# EAGLE design ir02 (EAGLE 9.6.2)
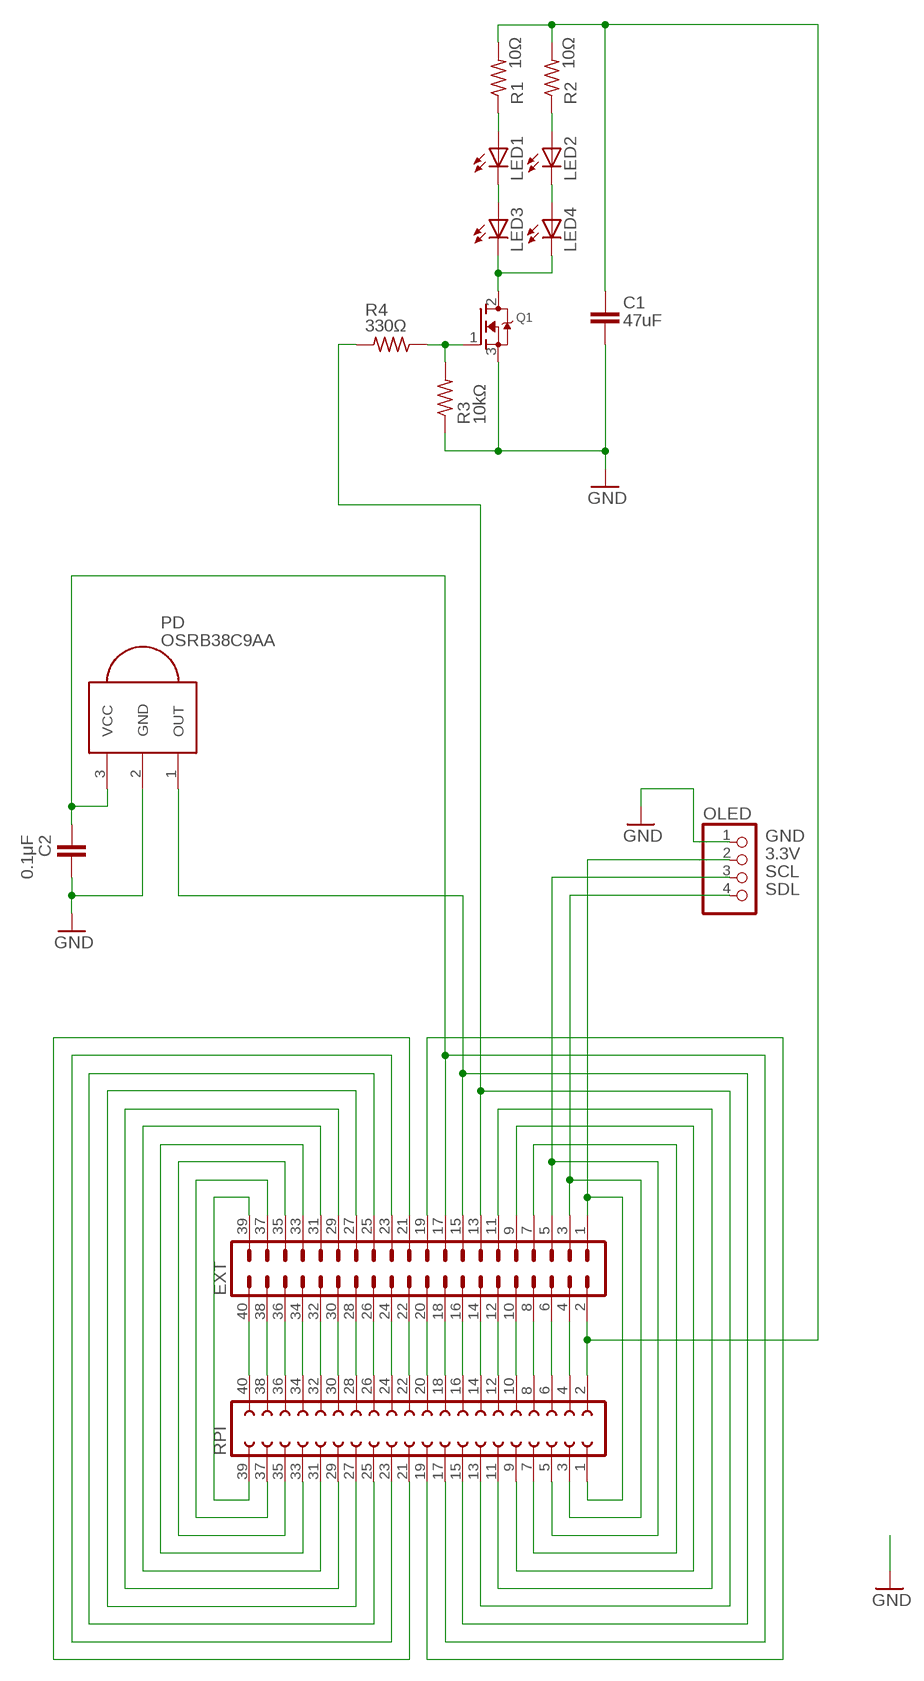
[diagram p0: schematic, sheet 1]

## Parts
C1  47uF  C-EU025-025X050  [C025-025X050]
C2  0.1μF  C-EU025-025X050  [C025-025X050]
EXT  MA20-2  [MA20-2]
LED1  LED3MM  [LED3MM]
LED2  LED3MM  [LED3MM]
LED3  LED3MM  [LED3MM]
LED4  LED3MM  [LED3MM]
OLED  PINHD-1X4  [1X04]
PD  OSRB38C9AA  PNA460XM  [PNA460XM]
Q1  MOSFET-NGDS_TO220V  [TO220V]
R1  10Ω  R-US_0204/5  [0204/5]
R2  10Ω  R-US_0204/5  [0204/5]
R3  10kΩ  R-US_0204/5  [0204/5]
R4  330Ω  R-US_0204/5  [0204/5]
RPI  FE20-2  [FE20-2]

## Nets
3.3V: C2.1 EXT.1 EXT.17 OLED.2 PD.3(VCC) RPI.1 RPI.17
5V: C1.1 EXT.2 R1.2 R2.2 RPI.2
GND: C1.2 C2.2 EXT.6 EXT.9 EXT.14 EXT.34 EXT.39 OLED.1 PD.2(GND) Q1.3(S) R3.1 RPI.6 RPI.9 RPI.14 RPI.34 RPI.39
N$1: Q1.1(G) R3.2 R4.1
N$4: LED1.A R1.1
N$5: LED2.A R2.1
N$6: EXT.15 PD.1(OUT) RPI.15
N$7: LED1.K(C) LED3.A
N$8: LED2.K(C) LED4.A
N$9: LED3.K(C) LED4.K(C) Q1.2(D)
N$10: EXT.4 RPI.4
N$12: EXT.8 RPI.8
N$13: EXT.10 RPI.10
N$14: EXT.12 RPI.12
N$16: EXT.16 RPI.16
N$17: EXT.18 RPI.18
N$18: EXT.20 RPI.20
N$19: EXT.22 RPI.22
N$20: EXT.24 RPI.24
N$21: EXT.26 RPI.26
N$22: EXT.28 RPI.28
N$23: EXT.30 RPI.30
N$24: EXT.32 RPI.32
N$26: EXT.36 RPI.36
N$27: EXT.38 RPI.38
N$28: EXT.40 RPI.40
N$32: EXT.7 RPI.7
N$34: EXT.11 RPI.11
N$35: EXT.13 R4.2 RPI.13
N$37: EXT.37 RPI.37
N$38: EXT.35 RPI.35
N$39: EXT.33 RPI.33
N$40: EXT.31 RPI.31
N$41: EXT.29 RPI.29
N$42: EXT.27 RPI.27
N$43: EXT.25 RPI.25
N$44: EXT.23 RPI.23
N$45: EXT.21 RPI.21
N$48: EXT.19 RPI.19
SCL: EXT.5 OLED.3 RPI.5
SDL: EXT.3 OLED.4 RPI.3

## Library data of the parts
C1 C2 = rcl:C-EU: CAPACITOR, European symbol; SPICEPREFIX: C
EXT = con-lstb:MA20-2: PIN HEADER; OC_FARNELL: unknown; OC_NEWARK: unknown
LED1-LED4 = adafruit:LED: LED OSRAM: - CHIPLED LG R971, LG N971, LY N971, LG Q971, LY Q971, LO R971, LY R971 LH N974, LH R974 LS Q976, LO Q976, LY Q976 LO Q996 - Hyper CHIPLED LW Q18S LB Q993, LB Q99A, LB R99A - SideLED LS A670, LO A670, LY A670, LG A670, LP A670 LB A673, LV A673, LT A673, LW A673 LH A674 LY A675 LS A676, LA A676, LO A676, LY A676, LW A676 LS A679, LY A679, LG A679 - Hyper Micro SIDELED® LS Y876, LA Y876, LO Y876, LY Y876 LT Y87S - SmartLED LW L88C, LW L88S LB L89C, LB L89S, LG L890 LS L89K, LO L89K, LY L89K LS L896, LA L896, LO L896, LY L896 - TOPLED LS T670, LO T670, LY T670, LG T670, LP T670 LSG T670, LSP T670, LSY T670, LOP T670, LYG T670 LG T671, LOG T671, LSG T671 LB T673, LV T673, LT T673, LW T673 LH T674 LS T676, LA T676, LO T676, LY T676, LB T676, LH T676, LSB T676, LW T676 LB T67C, LV T67C, LT T67C, LS T67K, LO T67K, LY T67K, LW E67C LS E67B, LA E67B, LO E67B, LY E67B, LB E67C, LV E67C, LT E67C LW T67C LS T679, LY T679, LG T679 LS T770, LO T770, LY T770, LG T770, LP T770 LB T773, LV T773, LT T773, LW T773 LH T774 LS E675, LA E675, LY E675, LS T675 LS T776, LA T776, LO T776, LY T776, LB T776 LHGB T686 LT T68C, LB T68C - Hyper Mini TOPLED® LB M676 - Mini TOPLED Santana® LG M470 LS M47K, LO M47K, LY M47K Source: http://www.osram.convergy.de/
OLED = pinhead:PINHD-1X4: PIN HEADER
PD = adafruit:PNA460XM: IR 38KHz receiver PNA4602 and related receivers http://www.ladyada.net/library/pcb/eaglelibrary.html
Q1 = adafruit:MOSFET-N: N-Channel Mosfet 2N7002E - 60V 260mA SOT23 [Digikey: 2N7002ET1GOSTR-ND] - REEL BSH103 - 30V 850mA SOT23 [Digikey: 568-5013-1-ND]
R1-R4 = rcl:R-US_: RESISTOR, American symbol; SPICEPREFIX: R
RPI = con-lsta:FE20-2: FEMALE HEADER; OC_FARNELL: unknown; OC_NEWARK: unknown

## Board
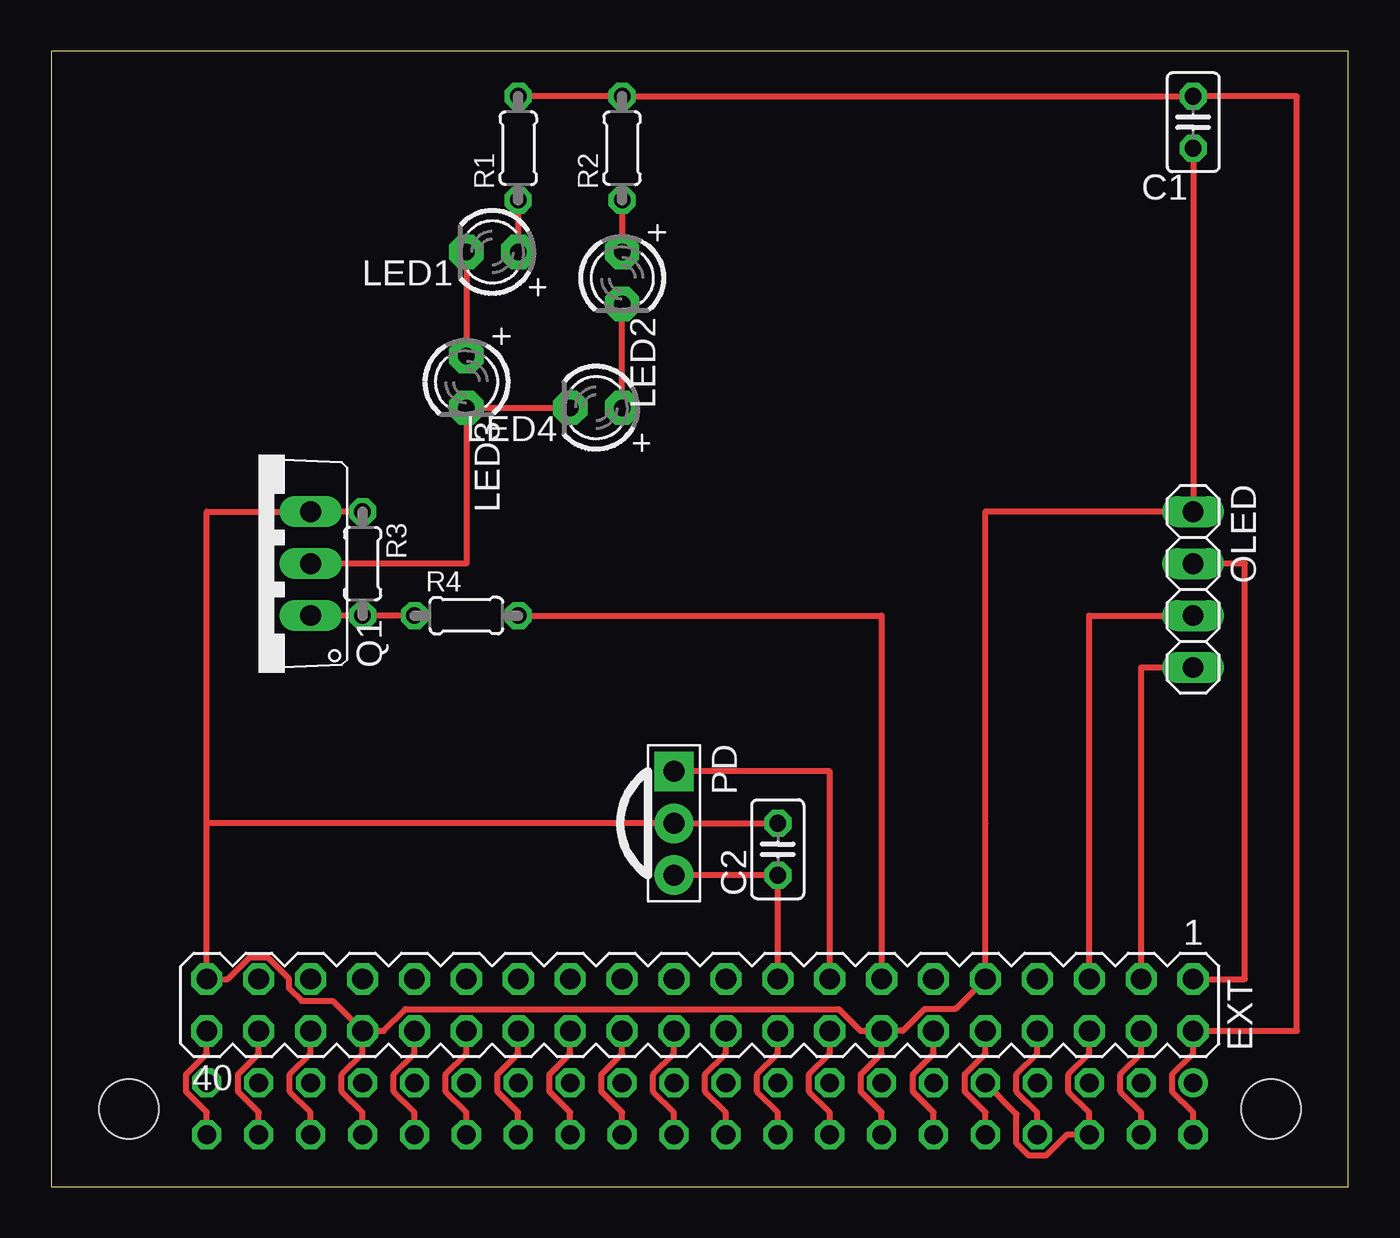
[diagram p1: board, top side]
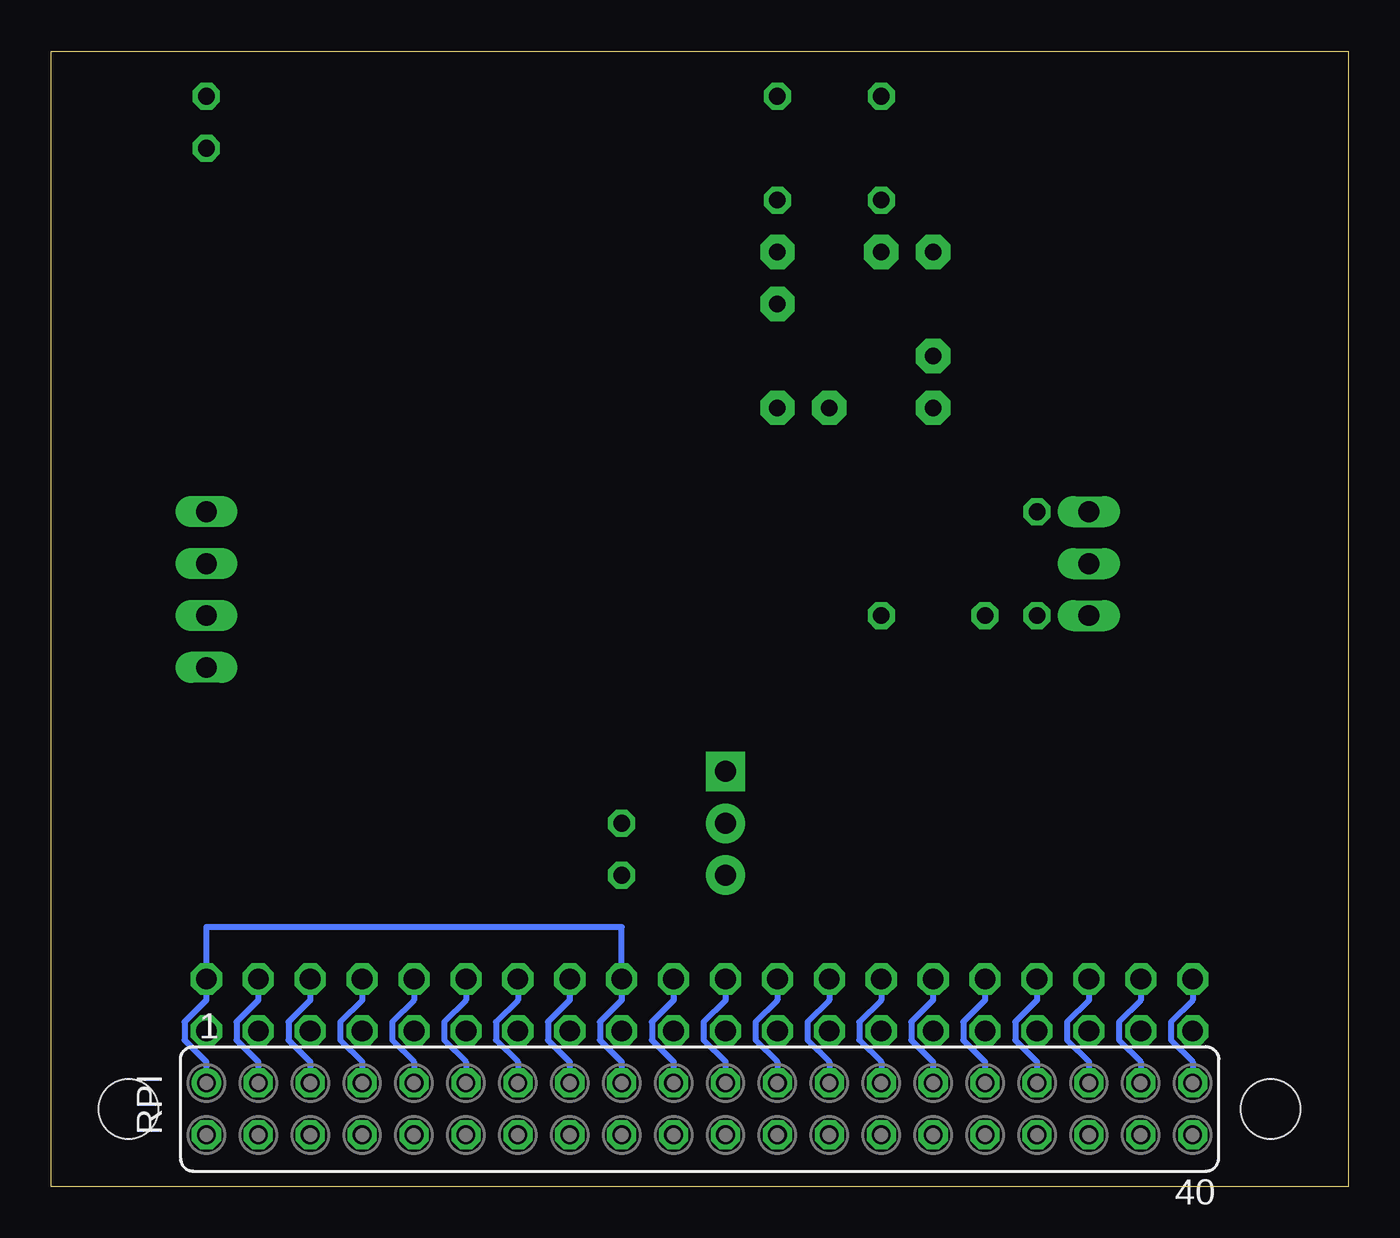
[diagram p2: board, bottom side, seen from below]

Size 63.48 x 55.55 mm. Coordinates in mm from the lower left corner, seen from the top.
Outline: 0,0 63.48,0 63.48,55.55 0,55.55 0,0
Copper layers (1*16): Top 0.035mm / dielectric 1.5mm / Bottom 0.035mm
Design rules "SeeedStudio_2layer_DRU_no_angle_20140221": minimum track width 6mil, minimum drill 12mil, track to track 6mil, track to pad 6mil, pad to pad 6mil, via to via 6mil, smd to smd 0mil, copper to edge 10mil, drill to drill 10mil, minimum pad ring 10mil, minimum via ring 6mil, stop-mask expansion 2mil, vias tented up to drill 100mil, thermal gap 10mil
Holes 2.9 mm at 3.81,3.81 59.69,3.81

### Footprints (pad centres in the part's own frame; a part is rotated, then mirrored left to right if it is on the bottom)
C025-025X050 = drill 0.813 octagon: 1 -1.27,0; 2 1.27,0
MA20-2 = drill 1.016 octagon: 1 -24.13,-1.27; 2 -24.13,1.27; 3 -21.59,-1.27; 4 -21.59,1.27; 5 -19.05,-1.27; 6 -19.05,1.27; 7 -16.51,-1.27; 8 -16.51,1.27; 9 -13.97,-1.27; 10 -13.97,1.27; 11 -11.43,-1.27; 12 -11.43,1.27; 13 -8.89,-1.27; 14 -8.89,1.27; 15 -6.35,-1.27; 16 -6.35,1.27; 17 -3.81,-1.27; 18 -3.81,1.27; 19 -1.27,-1.27; 20 -1.27,1.27; 21 1.27,-1.27; 22 1.27,1.27; 23 3.81,-1.27; 24 3.81,1.27; 25 6.35,-1.27; 26 6.35,1.27; 27 8.89,-1.27; 28 8.89,1.27; 29 11.43,-1.27; 30 11.43,1.27; 31 13.97,-1.27; 32 13.97,1.27; 33 16.51,-1.27; 34 16.51,1.27; 35 19.05,-1.27; 36 19.05,1.27; 37 21.59,-1.27; 38 21.59,1.27; 39 24.13,-1.27; 40 24.13,1.27
LED3MM = drill 0.813 pad 1.676 octagon: A -1.27,0; K 1.27,0
1X04 = drill 1.016 long: 1 -3.81,0; 2 -1.27,0; 3 1.27,0; 4 3.81,0
PNA460XM = drill 1.016 pad 1.93 square: 1 -2.54,0 | drill 1.016 pad 1.93: 2 0,0; 3 2.54,0
TO220V = drill 1.016 long: 1 -2.54,-2.54; 2 0,-2.54; 3 2.54,-2.54
0204/5 = drill 0.813 octagon: 1 -2.54,0; 2 2.54,0
FE20-2 = drill 0.914: 1 -24.13,1.27 | drill 0.914 octagon: 2 -24.13,-1.27; 3 -21.59,1.27; 4 -21.59,-1.27; 5 -19.05,1.27; 6 -19.05,-1.27; 7 -16.51,1.27; 8 -16.51,-1.27; 9 -13.97,1.27; 10 -13.97,-1.27; 11 -11.43,1.27; 12 -11.43,-1.27; 13 -8.89,1.27; 14 -8.89,-1.27; 15 -6.35,1.27; 16 -6.35,-1.27; 17 -3.81,1.27; 18 -3.81,-1.27; 19 -1.27,1.27; 20 -1.27,-1.27; 21 1.27,1.27; 22 1.27,-1.27; 23 3.81,1.27; 24 3.81,-1.27; 25 6.35,1.27; 26 6.35,-1.27; 27 8.89,1.27; 28 8.89,-1.27; 29 11.43,1.27; 30 11.43,-1.27; 31 13.97,1.27; 32 13.97,-1.27; 33 16.51,1.27; 34 16.51,-1.27; 35 19.05,1.27; 36 19.05,-1.27; 37 21.59,1.27; 38 21.59,-1.27; 39 24.13,1.27; 40 24.13,-1.27

### Placement (x,y rotation side)
C1  55.88,52.07 270 top
C2  35.56,16.51 90 top
EXT  31.75,8.89 180 top
LED1  21.59,45.72 180 top
LED2  27.94,44.45 270 top
LED3  20.32,39.37 270 top
LED4  26.67,38.1 180 top
OLED  55.88,29.21 270 top
PD  30.48,17.78 270 top
Q1  10.16,30.48 90 top
R1  22.86,50.8 90 top
R2  27.94,50.8 90 top
R3  15.24,30.48 270 top
R4  20.32,27.94 0 top
RPI  31.75,3.81 0 bottom

### Tracks (layer width: path | path; a pad name or v marks a point on that pad's centre or on a via)
3.3V
  Top 0.305: EXT.17 C2.1 PD.3 | EXT.1 58.42,10.16 58.42,30.48 OLED.2
  Bottom 0.305: RPI.17 35.56,6.11 36.63,7.18 36.63,8.06 35.56,9.13 EXT.17 35.56,12.7 55.88,12.7 EXT.1 55.88,9.13 56.95,8.06 56.95,7.18 55.88,6.11 RPI.1
5V
  Top 0.305: RPI.2 55.88,3.64 54.86,4.66 54.86,5.5 55.88,6.52 EXT.2 60.96,7.62 60.96,53.34 C1.1 R2.2 R1.2
GND
  Top 0.305: C2.2 PD.2 7.62,17.78 | RPI.14 40.64,3.64 39.62,4.66 39.62,5.5 40.64,6.52 EXT.14 | EXT.14 41.67,7.62 42.74,8.69 44.25,8.69 EXT.9 45.72,17.78 45.72,33.02 OLED.1 C1.2 | R3.1 Q1.3 7.62,33.02 7.62,17.78 | EXT.6 50.8,6.52 49.78,5.5 49.78,4.66 50.8,3.64 RPI.6 49.7,2.54 48.68,1.52 47.84,1.52 47.24,2.12 47.24,3.56 RPI.9 | RPI.34 15.24,3.64 14.22,4.66 14.22,5.5 15.24,6.52 EXT.34 | 7.62,17.78 EXT.39 8.65,10.16 9.72,11.23 10.6,11.23 11.63,10.2 11.63,9.72 12.26,9.09 13.77,9.09 EXT.34 | EXT.34 16.27,7.62 17.34,8.69 38.54,8.69 39.61,7.62 EXT.14
  Bottom 0.305: EXT.9 45.72,9.13 46.79,8.06 46.79,7.18 45.72,6.11 RPI.9 | EXT.39 7.62,9.13 8.69,8.06 8.69,7.18 7.62,6.11 RPI.39
N$1
  Top 0.305: Q1.1 R3.2 R4.1
N$4
  Top 0.305: R1.1 LED1.A
N$5
  Top 0.305: R2.1 LED2.A
N$6
  Top 0.305: PD.1 38.1,20.32 EXT.15
  Bottom 0.305: EXT.15 38.1,9.13 39.17,8.06 39.17,7.18 38.1,6.11 RPI.15
N$7
  Top 0.305: LED1.K LED3.A
N$8
  Top 0.305: LED4.A LED2.K
N$9
  Top 0.305: LED4.K LED3.K 20.32,30.48 Q1.2
N$10
  Top 0.305: RPI.4 53.34,3.64 52.32,4.66 52.32,5.5 53.34,6.52 EXT.4
N$12
  Top 0.305: RPI.8 48.26,3.64 47.24,4.66 47.24,5.5 48.26,6.52 EXT.8
N$13
  Top 0.305: RPI.10 45.72,3.64 44.7,4.66 44.7,5.5 45.72,6.52 EXT.10
N$14
  Top 0.305: RPI.12 43.18,3.64 42.16,4.66 42.16,5.5 43.18,6.52 EXT.12
N$16
  Top 0.305: RPI.16 38.1,3.64 37.08,4.66 37.08,5.5 38.1,6.52 EXT.16
N$17
  Top 0.305: RPI.18 35.56,3.64 34.54,4.66 34.54,5.5 35.56,6.52 EXT.18
N$18
  Top 0.305: RPI.20 33.02,3.64 32,4.66 32,5.5 33.02,6.52 EXT.20
N$19
  Top 0.305: RPI.22 30.48,3.64 29.46,4.66 29.46,5.5 30.48,6.52 EXT.22
N$20
  Top 0.305: RPI.24 27.94,3.64 26.92,4.66 26.92,5.5 27.94,6.52 EXT.24
N$21
  Top 0.305: RPI.26 25.4,3.64 24.38,4.66 24.38,5.5 25.4,6.52 EXT.26
N$22
  Top 0.305: RPI.28 22.86,3.64 21.84,4.66 21.84,5.5 22.86,6.52 EXT.28
N$23
  Top 0.305: RPI.30 20.32,3.64 19.3,4.66 19.3,5.5 20.32,6.52 EXT.30
N$24
  Top 0.305: RPI.32 17.78,3.64 16.76,4.66 16.76,5.5 17.78,6.52 EXT.32
N$26
  Top 0.305: RPI.36 12.7,3.64 11.68,4.66 11.68,5.5 12.7,6.52 EXT.36
N$27
  Top 0.305: RPI.38 10.16,3.64 9.14,4.66 9.14,5.5 10.16,6.52 EXT.38
N$28
  Top 0.305: RPI.40 7.62,3.64 6.6,4.66 6.6,5.5 7.62,6.52 EXT.40
N$32
  Bottom 0.305: EXT.7 48.26,9.13 49.33,8.06 49.33,7.18 48.26,6.11 RPI.7
N$34
  Bottom 0.305: EXT.11 43.18,9.13 44.25,8.06 44.25,7.18 43.18,6.11 RPI.11
N$35
  Top 0.305: R4.2 40.64,27.94 EXT.13
  Bottom 0.305: EXT.13 40.64,9.13 41.71,8.06 41.71,7.18 40.64,6.11 RPI.13
N$37
  Bottom 0.305: EXT.37 10.16,9.13 11.23,8.06 11.23,7.18 10.16,6.11 RPI.37
N$38
  Bottom 0.305: EXT.35 12.7,9.13 13.77,8.06 13.77,7.18 12.7,6.11 RPI.35
N$39
  Bottom 0.305: EXT.33 15.24,9.13 16.31,8.06 16.31,7.18 15.24,6.11 RPI.33
N$40
  Bottom 0.305: EXT.31 17.78,9.13 18.85,8.06 18.85,7.18 17.78,6.11 RPI.31
N$41
  Bottom 0.305: EXT.29 20.32,9.13 21.39,8.06 21.39,7.18 20.32,6.11 RPI.29
N$42
  Bottom 0.305: EXT.27 22.86,9.13 23.93,8.06 23.93,7.18 22.86,6.11 RPI.27
N$43
  Bottom 0.305: EXT.25 25.4,9.13 26.47,8.06 26.47,7.18 25.4,6.11 RPI.25
N$44
  Bottom 0.305: EXT.23 27.94,9.13 29.01,8.06 29.01,7.18 27.94,6.11 RPI.23
N$45
  Bottom 0.305: EXT.21 30.48,9.13 31.55,8.06 31.55,7.18 30.48,6.11 RPI.21
N$48
  Bottom 0.305: EXT.19 33.02,9.13 34.09,8.06 34.09,7.18 33.02,6.11 RPI.19
SCL
  Top 0.305: EXT.5 50.8,27.94 OLED.3
  Bottom 0.305: EXT.5 50.8,9.13 51.87,8.06 51.87,7.18 50.8,6.11 RPI.5
SDL
  Top 0.305: EXT.3 53.34,25.4 OLED.4
  Bottom 0.305: EXT.3 53.34,9.13 54.41,8.06 54.41,7.18 53.34,6.11 RPI.3